# Altium project HainanU-Shark-X-Controller.PrjPcb
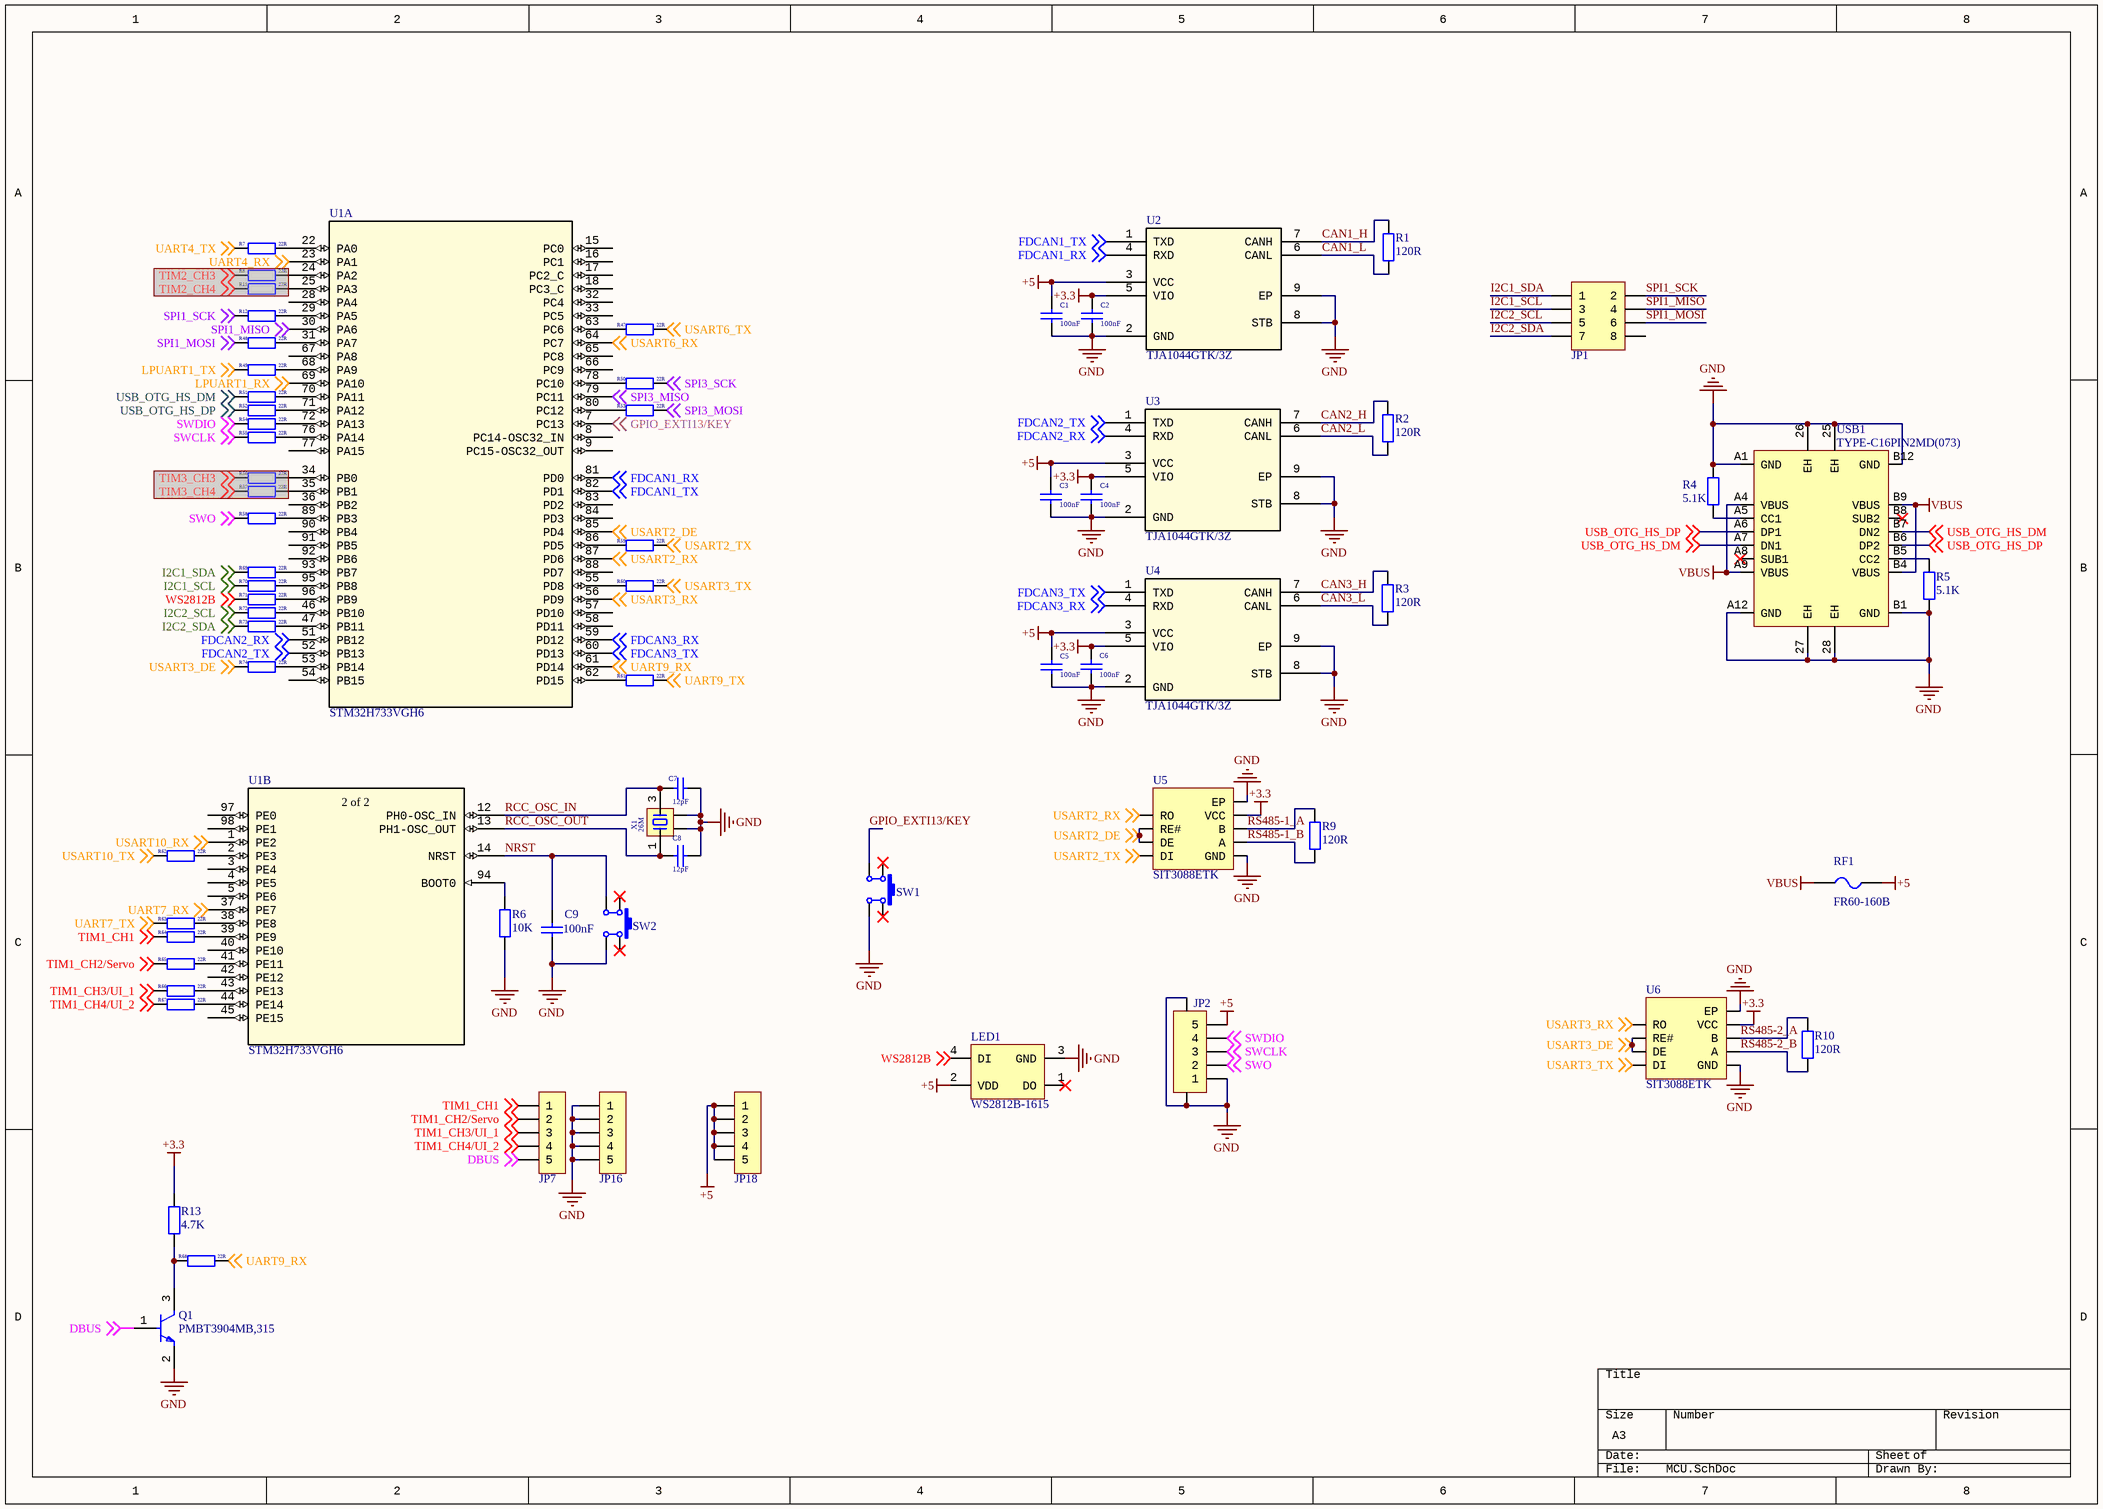
[diagram p0: MCU.SchDoc]
3 sheets, 178 parts. Net scope: global (net labels, ports and power ports of the same name join across sheets).
Board file: HainanU-Shark-X-Controller.PcbDoc
Sheets:
  MCU.SchDoc
  Power.SchDoc
  Sheet1.SchDoc

## Sheet MCU.SchDoc
size A3; SheetNumber: 1; SheetTotal: 3

### Parts
C1  100nF  [C0402_L]
C2  100nF  [C0402_L]
C3  100nF  [C0402_L]
C4  100nF  [C0402_L]
C5  100nF  [C0402_L]
C6  100nF  [C0402_L]
C7  12pF  [C0402_L]
C8  12pF  [C0402_L]
C9  100nF  [C0402_L]
JP1  Header 4X2  [IDC2.54-LI-2x4P]  (value not drawn)
JP2  CON-5P  [SH1.0-WT-5P]  (value not drawn)
JP7  HDR-1X5  [HDR2.54-LI-5P]  (value not drawn)
JP16  HDR-1X5  [HDR2.54-LI-5P]  (value not drawn)
JP18  HDR-1X5  [HDR2.54-LI-5P]  (value not drawn)
LED1  WS2812B-1615  [XL-1615RGBC-WS2812B]
Q1  PMBT3904MB,315  [FP-SOT883B-MFG]
R1  120R  [R0402_M]
R2  120R  [R0402_M]
R3  120R  [R0402_M]
R4  5.1K  [R0402_M]
R5  5.1K  [R0402_M]
R6  10K  [R0402_M]
R7  22R  [R0402_M]
R8  22R  [R0402_M]  (masked out: inside a compile mask, not in the netlist)
R9  120R  [R0402_M]
R10  120R  [R0402_M]
R11  22R  [R0402_M]  (masked out: inside a compile mask, not in the netlist)
R12  22R  [R0402_M]
R13  4.7K  [R0402_M]
R47  22R  [R0402_M]
R48  22R  [R0402_M]
R49  22R  [R0402_M]
R50  22R  [R0402_M]
R51  22R  [R0402_M]
R52  22R  [R0402_M]
R53  22R  [R0402_M]
R54  22R  [R0402_M]
R55  22R  [R0402_M]
R56  22R  [R0402_M]  (masked out: inside a compile mask, not in the netlist)
R57  22R  [R0402_M]  (masked out: inside a compile mask, not in the netlist)
R58  22R  [R0402_M]
R59  22R  [R0402_M]
R60  22R  [R0402_M]
R61  22R  [R0402_M]
R62  22R  [R0402_M]
R63  22R  [R0402_M]
R64  22R  [R0402_M]
R65  22R  [R0402_M]
R66  22R  [R0402_M]
R67  22R  [R0402_M]
R68  22R  [R0402_M]
R69  22R  [R0402_M]
R70  22R  [R0402_M]
R71  22R  [R0402_M]
R72  22R  [R0402_M]
R73  22R  [R0402_M]
R74  22R  [R0402_M]
RF1  FR60-160B  [F0603]
SW1  TD-1187SA-250  [SW-SMD-3.5*3.0_4P]  (value not drawn)
SW2  TD-1187SA-250  [SW-SMD-3.5*3.0_4P]  (value not drawn)
U1  STM32H733VGH6  [LQFP100_STM]  (parts A,B of 3)
U2  TJA1044GTK/3Z  [SON8_TJA1044GTK3Z_NXP-L]
U3  TJA1044GTK/3Z  [SON8_TJA1044GTK3Z_NXP-L]
U4  TJA1044GTK/3Z  [SON8_TJA1044GTK3Z_NXP-L]
U5  SIT3088ETK  [DFN-8_L3.0-W3.0-P0.65-BL-EP]
U6  SIT3088ETK  [DFN-8_L3.0-W3.0-P0.65-BL-EP]
USB1  TYPE-C16PIN2MD(073)  [USB-C-SMD_SHOU_TYPE-C-16P-CB1.6]
X1  26M  [XTAL-3225-4P]

### Nets
+3.3: C2.1 C4.1 C6.1 R13.1 U2.5(VIO) U3.5(VIO) U4.5(VIO) U5.8(VCC) U6.8(VCC)
+5: C1.1 C3.1 C5.1 JP2.5 JP18.1 JP18.2 JP18.3 JP18.4 JP18.5 LED1.2(VDD) RF1.1 U2.3(VCC) U3.3(VCC) U4.3(VCC)
GND: C1.2 C2.2 C3.2 C4.2 C5.2 C6.2 C7.2 C8.2 C9.2 JP2.0 JP2.1 JP16.1 JP16.2 JP16.3 JP16.4 JP16.5 LED1.3(GND) Q1.2(E) R4.2 R5.2 R6.1 SW1.3 SW2.3 U2.2(GND) U2.8(STB) U2.9(EP) U3.2(GND) U3.8(STB) U3.9(EP) U4.2(GND) U4.8(STB) U4.9(EP) U5.5(GND) U5.9(EP) U6.5(GND) U6.9(EP) USB1.25(EH) USB1.26(EH) USB1.27(EH) USB1.28(EH) USB1.A1(GND) USB1.A12(GND) USB1.B1(GND) USB1.B12(GND) X1.2 X1.4
VBUS: RF1.2 USB1.A4(VBUS) USB1.A9(VBUS) USB1.B4(VBUS) USB1.B9(VBUS)
CAN1_H: R1.2 U2.7(CANH)
CAN1_L: R1.1 U2.6(CANL)
CAN2_H: R2.2 U3.7(CANH)
CAN2_L: R2.1 U3.6(CANL)
CAN3_H: R3.2 U4.7(CANH)
CAN3_L: R3.1 U4.6(CANL)
DBUS: JP7.5 Q1.1(B) ; off-sheet DBUS
FDCAN1_RX: U1.81(PD0) U2.4(RXD) ; off-sheet FDCAN1_RX
FDCAN1_TX: U1.82(PD1) U2.1(TXD) ; off-sheet FDCAN1_TX
FDCAN2_RX: U1.51(PB12) U3.4(RXD) ; off-sheet FDCAN2_RX
FDCAN2_TX: U1.52(PB13) U3.1(TXD) ; off-sheet FDCAN2_TX
FDCAN3_RX: U1.59(PD12) U4.4(RXD) ; off-sheet FDCAN3_RX
FDCAN3_TX: U1.60(PD13) U4.1(TXD) ; off-sheet FDCAN3_TX
GPIO_EXTI13/KEY: SW1.4 U1.7(PC13) ; off-sheet GPIO_EXTI13/KEY
I2C1_SCL: JP1.3 R70.2 ; off-sheet I2C1_SCL
I2C1_SDA: JP1.1 R69.2 ; off-sheet I2C1_SDA
I2C2_SCL: JP1.5 R72.2 ; off-sheet I2C2_SCL
I2C2_SDA: JP1.7 R73.2 ; off-sheet I2C2_SDA
LPUART1_RX: U1.69(PA10) ; off-sheet LPUART1_RX
LPUART1_TX: R49.2 ; off-sheet LPUART1_TX
NRST: C9.1 SW2.4 U1.14(NRST)
RCC_OSC_IN: C7.1 U1.12(PH0-OSC_IN) X1.3
RCC_OSC_OUT: C8.1 U1.13(PH1-OSC_OUT) X1.1
RS485-1_A: R9.2 U5.7(B)
RS485-1_B: R9.1 U5.6(A)
RS485-2_A: R10.2 U6.7(B)
RS485-2_B: R10.1 U6.6(A)
SPI1_MISO: JP1.4 U1.30(PA6) ; off-sheet SPI1_MISO
SPI1_MOSI: JP1.6 R48.2 ; off-sheet SPI1_MOSI
SPI1_SCK: JP1.2 R12.2 ; off-sheet SPI1_SCK
SPI3_MISO: U1.79(PC11) ; off-sheet SPI3_MISO
SPI3_MOSI: R53.1 ; off-sheet SPI3_MOSI
SPI3_SCK: R50.1 ; off-sheet SPI3_SCK
SWCLK: JP2.3 R55.2 ; off-sheet SWCLK
SWDIO: JP2.4 R54.2 ; off-sheet SWDIO
SWO: JP2.2 R58.2 ; off-sheet SWO
TIM1_CH1: JP7.1 R64.2 ; off-sheet TIM1_CH1
TIM1_CH2/Servo: JP7.2 R65.2 ; off-sheet TIM1_CH2/Servo
TIM1_CH3/UI_1: JP7.3 R66.2 ; off-sheet TIM1_CH3/UI_1
TIM1_CH4/UI_2: JP7.4 R67.2 ; off-sheet TIM1_CH4/UI_2
UART4_RX: U1.23(PA1) ; off-sheet UART4_RX
UART4_TX: R7.2 ; off-sheet UART4_TX
UART7_RX: U1.37(PE7) ; off-sheet UART7_RX
UART7_TX: R63.2 ; off-sheet UART7_TX
UART9_RX: R68.1 U1.61(PD14) ; off-sheet UART9_RX
UART9_TX: R61.1 ; off-sheet UART9_TX
USART2_DE: U1.85(PD4) U5.2(RE#) U5.3(DE) ; off-sheet USART2_DE
USART2_RX: U1.87(PD6) U5.1(RO) ; off-sheet USART2_RX
USART2_TX: R59.1 U5.4(DI) ; off-sheet USART2_TX
USART3_DE: R74.2 U6.2(RE#) U6.3(DE) ; off-sheet USART3_DE
USART3_RX: U1.56(PD9) U6.1(RO) ; off-sheet USART3_RX
USART3_TX: R60.1 U6.4(DI) ; off-sheet USART3_TX
USART6_RX: U1.64(PC7) ; off-sheet USART6_RX
USART6_TX: R47.1 ; off-sheet USART6_TX
USART10_RX: U1.1(PE2) ; off-sheet USART10_RX
USART10_TX: R62.2 ; off-sheet USART10_TX
USB_OTG_HS_DM: R51.2 USB1.A7(DN1) USB1.B7(DN2) ; off-sheet USB_OTG_HS_DM
USB_OTG_HS_DP: R52.2 USB1.A6(DP1) USB1.B6(DP2) ; off-sheet USB_OTG_HS_DP
WS2812B: LED1.4(DI) R71.2 ; off-sheet WS2812B
NetQ1_3: Q1.3(C) R13.2 R68.2
NetR4_1: R4.1 USB1.A5(CC1)
NetR5_1: R5.1 USB1.B5(CC2)
NetR6_2: R6.2 U1.94(BOOT0)
NetR7_1: R7.1 U1.22(PA0)
NetR12_1: R12.1 U1.29(PA5)
NetR47_2: R47.2 U1.63(PC6)
NetR48_1: R48.1 U1.31(PA7)
NetR49_1: R49.1 U1.68(PA9)
NetR50_2: R50.2 U1.78(PC10)
NetR51_1: R51.1 U1.70(PA11)
NetR52_1: R52.1 U1.71(PA12)
NetR53_2: R53.2 U1.80(PC12)
NetR54_1: R54.1 U1.72(PA13)
NetR55_1: R55.1 U1.76(PA14)
NetR58_1: R58.1 U1.89(PB3)
NetR59_2: R59.2 U1.86(PD5)
NetR60_2: R60.2 U1.55(PD8)
NetR61_2: R61.2 U1.62(PD15)
NetR62_1: R62.1 U1.2(PE3)
NetR63_1: R63.1 U1.38(PE8)
NetR64_1: R64.1 U1.39(PE9)
NetR65_1: R65.1 U1.41(PE11)
NetR66_1: R66.1 U1.43(PE13)
NetR67_1: R67.1 U1.44(PE14)
NetR69_1: R69.1 U1.93(PB7)
NetR70_1: R70.1 U1.95(PB8)
NetR71_1: R71.1 U1.96(PB9)
NetR72_1: R72.1 U1.46(PB10)
NetR73_1: R73.1 U1.47(PB11)
NetR74_1: R74.1 U1.53(PB14)

Not connected (* = marked no-connect by the designer): JP1 8; LED1 1(DO)*; SW1 1* 2*; SW2 1* 2*; U1 3(PE4) 4(PE5) 5(PE6) 8(PC14-OSC32_IN) 9(PC15-OSC32_OUT) 15(PC0) 16(PC1) 17(PC2_C) 18(PC3_C) 24(PA2) 25(PA3) 28(PA4) 32(PC4) 33(PC5) 34(PB0) 35(PB1) 36(PB2) 40(PE10) 42(PE12) 45(PE15) 54(PB15) 57(PD10) 58(PD11) 65(PC8) 66(PC9) 67(PA8) 77(PA15) 83(PD2) 84(PD3) 88(PD7) 90(PB4) 91(PB5) 92(PB6) 97(PE0) 98(PE1); USB1 A8(SUB1)* B8(SUB2)*

### Notes on the sheet
- (in symbol CMP-00027-1, part B) 2 of 2

### Library data of the parts
C1-C9 = C: 贴片电容/MLCC电容; BOM名称: 无极性贴片电容; 当前库版本V2023.5.31 @淘宝卖家:黄晶宝石: 最新版本发布https://item.taobao.com/item.htm?id=566775463719
JP1 = Header 4X2: 4*2P接插件; 联系卖家，免费查找封装: 唯一出售店铺网址https://shop463601444.taobao.com; 封装库来自淘宝卖家ID：黄晶宝石: 其他店铺购入均为盗版封装库，请立即申请退款，本店现金奖励50~200元; BOM名称: 4*2P接插件
JP2 = Header 5: 5P连接器; 封装库来自淘宝卖家：黄晶宝石: 获取最新版本https://shop463601444.taobao.com; BOM名称: 5P连接器
JP7 JP16 JP18 = Header 5: 5P接插件; 联系卖家，免费查找封装: 唯一出售店铺网址https://shop463601444.taobao.com; 封装库来自淘宝卖家ID：黄晶宝石: 其他店铺购入均为盗版封装库，请立即申请退款，本店现金奖励50~200元; BOM名称: 5P接插件
LED1 = CMP-00052-1: LED幻彩灯珠
Q1 = CMP-14406-000022-1: TRANS NPN 40V 0.2A 3DFN
R1-R12 R47-R74 = R: 贴片电阻; 联系下单店铺卖家 免费帮你查找封装: 联系下单店铺卖家 免费技术支持; BOM名称: 贴片电阻
R13 = CMP-005-000000-1: 贴片电阻; 联系下单店铺卖家 免费帮你查找封装: 联系下单店铺卖家 免费技术支持; BOM名称: 贴片电阻; Source: 0.1 - 电阻-电容-电感-保险丝-晶振-晶体-磁珠-电位器-法拉电容-馈通电容.SchLib; Design Item ID: R
RF1 = FUSE-PPTC: PPTC自恢复保险丝; 当前库版本V2023.5.31 @淘宝卖家:黄晶宝石: 最新版本发布https://item.taobao.com/item.htm?id=566775463719; BOM名称: PPTC自恢复保险丝
SW1 SW2 = TD-1187SA-250: 小乌龟-侧按4脚开关 带定位柱; 联系下单店铺卖家 免费技术支持: 联系下单店铺卖家 免费帮你查找封装
U1 = CMP-00027-1: High-performance and DSP with DP-FPU, Arm Cortex-M7 MCU with 1 MByte Flash, 564 Kbytes RAM, 550 MHz CPU, L1 cache,...
U2-U4 = CMP-00028-4: CAN High Speed Transceiver 1Mbps Normal/Standby 4.75V to 5.25V 8-Pin HVSON T/R
U5 U6 = CMP-00068-2
USB1 = CMP-00067-1
X1 = XTAL-4P: 4脚无源晶振(谐振器）; 联系下单店铺卖家 免费帮你查找封装: 联系下单店铺卖家 免费技术支持; BOM名称: 4脚无源晶振(谐振器）

## Sheet Power.SchDoc
size A3; SheetNumber: 2; SheetTotal: 3
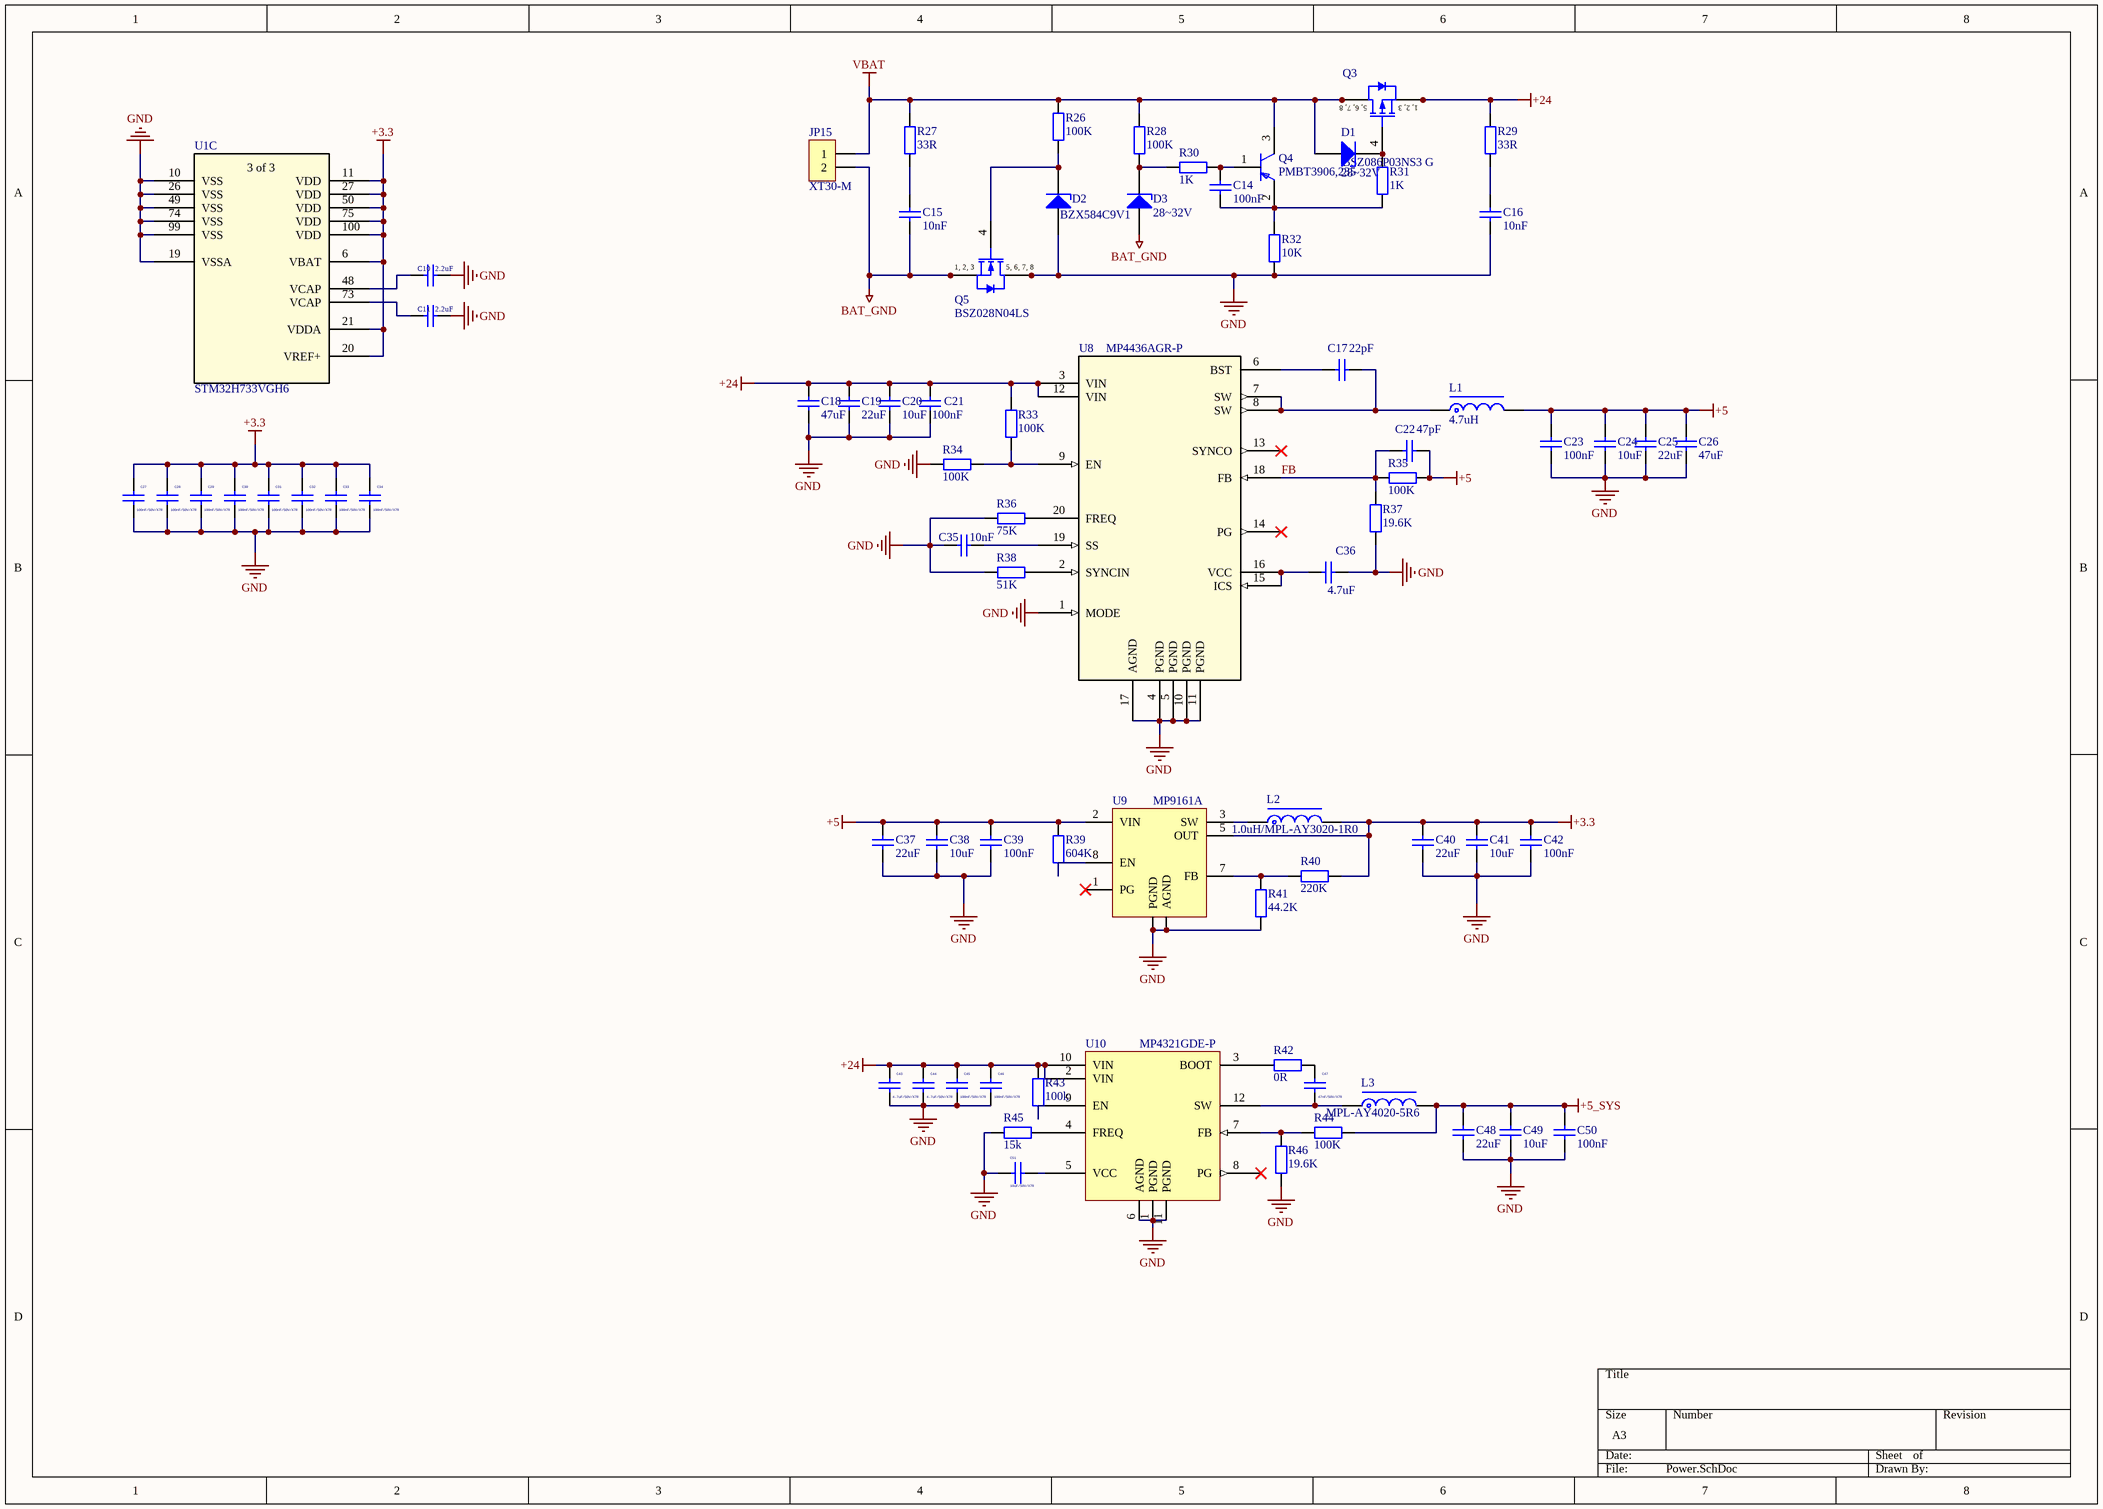
[diagram p1: Power.SchDoc]

### Parts
C10  2.2uF  [C0402_L]
C11  2.2uF  [C0402_L]
C14  100nF  [C0402_M]
C15  10nF  [C0402_M]
C16  10nF  [C0402_M]
C17  22pF  [C0402_M]
C18  47uF  [C1206_L]
C19  22uF  [C0805_L]
C20  10uF  [C0603_L]
C21  100nF  [C0603_L]
C22  47pF  [C0402_M]
C23  100nF  [C0603_L]
C24  10uF  [C0603_L]
C25  22uF  [C0805_L]
C26  47uF  [C1206_L]
C27  100nF/50V/X7R  [C0402_L]
C28  100nF/50V/X7R  [C0402_L]
C29  100nF/50V/X7R  [C0402_L]
C30  100nF/50V/X7R  [C0402_L]
C31  100nF/50V/X7R  [C0402_L]
C32  100nF/50V/X7R  [C0402_L]
C33  100nF/50V/X7R  [C0402_L]
C34  100nF/50V/X7R  [C0402_L]
C35  10nF  [C0402_M]
C36  4.7uF  [C0402_M]
C37  22uF  [C0805_M]
C38  10uF  [C0603_M]
C39  100nF  [C0402_M]
C40  22uF  [C0603_M]
C41  10uF  [C0402_M]
C42  100nF  [C0402_M]
C43  4.7uF/50V/X7R  [C0402_L]
C44  4.7uF/50V/X7R  [C0402_L]
C45  100nF/50V/X7R  [C0402_L]
C46  100nF/50V/X7R  [C0402_L]
C47  47nF/50V/X7R  [C0402_L]
C48  22uF  [C0603_M]
C49  10uF  [C0402_M]
C50  100nF  [C0402_M]
C51  10uF/50V/X7R  [C0402_L]
D1  28~32V  [SOD-523]
D2  BZX584C9V1  [SOD-523]
D3  28~32V  [SOD-523]
JP15  XT30-M  [XT30PW-M]
L1  4.7uH  [MPL-AL6050]
L2  1.0uH/MPL-AY3020-1R0  [MPL-AY3020]
L3  MPL-AY4020-5R6  [MPL-AY4020]
Q3  BSZ086P03NS3 G  [INF-PG-TSDSON-8-1_V]
Q4  PMBT3906,235  [FP-SOT23-IPC_C]
Q5  BSZ028N04LS  [INF-PG-TSDSON-8_FL_V]
R26  100K  [R0402_M]
R27  33R  [R0402_M]
R28  100K  [R0402_M]
R29  33R  [R0402_M]
R30  1K  [R0402_M]
R31  1K  [R0402_M]
R32  10K  [R0402_M]
R33  100K  [R0402_M]
R34  100K  [R0402_M]
R35  100K  [R0402_M]
R36  75K  [R0402_M]
R37  19.6K  [R0402_M]
R38  51K  [R0402_M]
R39  604K  [R0402_L]
R40  220K  [R0402_L]
R41  44.2K  [R0402_L]
R42  0R  [R0402_L]
R43  100k  [R0402_L]
R44  100K  [R0402_L]
R45  15k  [R0402_L]
R46  19.6K  [R0402_L]
U1  STM32H733VGH6  [LQFP100_STM]  (part C of 3)
U8  MP4436AGR-P  [QFN-20_4MMX4MM_MPS]
U9  MP9161A  [SOT23-8]
U10  MP4321GDE-P  [QFN-12_MP4321_MNP]

### Nets
+3.3: C27.2 C28.2 C29.2 C30.2 C31.2 C32.2 C33.2 C34.2 C40.2 C41.2 C42.2 L2.2 R40.2 U1.6(VBAT) U1.11(VDD) U1.20(VREF+) U1.21(VDDA) U1.27(VDD) U1.50(VDD) U1.75(VDD) U1.100(VDD) U9.5(OUT)
+5: C22.2 C23.2 C24.2 C25.2 C26.1 C37.2 C38.2 C39.2 L1.2 R35.2 R39.2 U9.2(VIN)
+5_SYS: C48.2 C49.2 C50.2 L3.2 R44.1
+24: C18.1 C19.1 C20.1 C21.1 C43.2 C44.2 C45.2 C46.2 Q3.1(SOURCE) Q3.2(SOURCE) Q3.3(SOURCE) R29.1 R33.2 R43.2 U8.3(VIN) U8.12(VIN) U10.2(VIN) U10.10(VIN)
BAT_GND: C15.2 D3.1(A) JP15.2 Q5.1(SOURCE) Q5.2(SOURCE) Q5.3(SOURCE)
GND: C10.2 C11.2 C16.2 C18.2 C19.2 C20.2 C21.2 C23.1 C24.1 C25.1 C26.2 C27.1 C28.1 C29.1 C30.1 C31.1 C32.1 C33.1 C34.1 C35.1 C36.1 C37.1 C38.1 C39.1 C40.1 C41.1 C42.1 C43.1 C44.1 C45.1 C46.1 C48.1 C49.1 C50.1 C51.2 D2.1(A) Q5.5(DRAIN) Q5.6(DRAIN) Q5.7(DRAIN) Q5.8(DRAIN) R32.2 R34.2 R36.2 R37.1 R38.2 R41.2 R45.2 R46.2 U1.10(VSS) U1.19(VSSA) U1.26(VSS) U1.49(VSS) U1.74(VSS) U1.99(VSS) U8.1(MODE) U8.4(PGND) U8.5(PGND) U8.10(PGND) U8.11(PGND) U8.17(AGND) U9.4(PGND) U9.6(AGND) U10.1(PGND) U10.6(AGND) U10.11(PGND)
VBAT: D1.1(A) JP15.1 Q3.5(DRAIN) Q3.6(DRAIN) Q3.7(DRAIN) Q3.8(DRAIN) Q4.3(C) R26.2 R27.2 R28.2
FB: C22.1 R35.1 R37.2 U8.18(FB)
NetC10_1: C10.1 U1.48(VCAP)
NetC11_1: C11.1 U1.73(VCAP)
NetC14_1: C14.1 Q4.1(B) R30.1
NetC14_2: C14.2 Q4.2(E) R31.2 R32.1
NetC15_1: C15.1 R27.1
NetC16_1: C16.1 R29.2
NetC17_1: C17.1 U8.6(BST)
NetC17_2: C17.2 L1.1 U8.7(SW) U8.8(SW)
NetC35_2: C35.2 U8.19(SS)
NetC36_2: C36.2 U8.15(ICS) U8.16(VCC)
NetC47_1: C47.1 L3.1 U10.12(SW)
NetC47_2: C47.2 R42.1
NetC51_1: C51.1 U10.5(VCC)
NetD1_2: D1.2(K) Q3.4(GATE) R31.1
NetD2_2: D2.2(K) Q5.4(GATE) R26.1
NetD3_2: D3.2(K) R28.1 R30.2
NetL2_1: L2.1 U9.3(SW)
NetR33_1: R33.1 R34.1 U8.9(EN)
NetR36_1: R36.1 U8.20(FREQ)
NetR38_1: R38.1 U8.2(SYNCIN)
NetR39_1: R39.1 U9.8(EN)
NetR40_1: R40.1 R41.1 U9.7(FB)
NetR42_2: R42.2 U10.3(BOOT)
NetR43_1: R43.1 U10.9(EN)
NetR44_2: R44.2 R46.1 U10.7(FB)
NetR45_1: R45.1 U10.4(FREQ)

Not connected (* = marked no-connect by the designer): U8 13(SYNCO)* 14(PG)*; U9 1(PG)*; U10 8(PG)*

### Notes on the sheet
- (in symbol CMP-00027-1, part C) 3 of 3
- (in symbol CMP-1091-00292-1) 1, 2, 3; 5, 6, 7, 8
- (in symbol CMP-1099-00063-1) 5, 6, 7, 8; 1, 2, 3

### Library data of the parts
C10 C11 C18-C21 C23-C51 = C: as C1 on sheet MCU
C14-C17 C22 = CMP-002-000000-1: 贴片电容/MLCC电容; BOM名称: 无极性贴片电容; 当前库版本V2023.5.31 @淘宝卖家:黄晶宝石: 最新版本发布https://item.taobao.com/item.htm?id=566775463719; Design Item ID: C; Source: 0.1 - 电阻-电容-电感-保险丝-晶振-晶体-磁珠-电位器-法拉电容-馈通电容.SchLib
D1-D3 = 稳压二极管: Zener Diode; 当前库版本V2023.5.31 @淘宝卖家:黄晶宝石: 最新版本发布https://shop463601444.taobao.com
JP15 = XT30-M: XT30公头; 当前库版本V2023.5.31 @淘宝卖家:黄晶宝石: 最新版本发布https://shop463601444.taobao.com
L1-L3 = L-Molding Choke: 一体成型电感; 当前库版本V2023.5.31 @淘宝卖家:黄晶宝石: 最新版本发布https://item.taobao.com/item.htm?id=566775463719; BOM名称: 一体成型电感
Q3 = CMP-1099-00063-1: P-Channel OptiMOS P3 Power-Transistor, -30 V VDS, -40 A ID, -55 to 150 degC, PG-TSDSON-8-1, Reel, Green; Manufacturer: Infineon; RDS (on) (max): 8.6Â mOhm; Rth: 1.8Â K/W; QG: 43.2Â nC; VGS(th) (max): -1.9Â V; RthJC (max): 1.8 K/W; Green: TRUE; Pto t (max): 69Â W; ID (max): -40Â A; IDpuls (max): -160Â A; VDS (max): -30Â V; VGS(th) (min): -3.1Â V; ComponentLink1URL: http://www.infineon.com/; ComponentLink2URL: http://www.infineon.com/dgdl/BSZ086P03NS3+G_2.03.pdf?folderId=db3a304314dca38901154a7313d21a66&fileId=db3a30431ff9881501203d3a5e7d17a9; Mounting Technology: Surface Mount; PartNumber: BSZ086P03NS3 G; Packing: Reel; PackageVersion: Rev. 02, 09/2008; Halogen-free: TRUE; ComponentLink3URL: http://www.infineon.com/dgdl/BSZ240N12NS3+Rev2.0.pdf?folderId=db3a304313b8b5a60113cee8763b02d7&fileId=db3a30432a40a650012a42f3057a0038; PackageDescription: 8-Pin Plastic (Green) Thin Dual Small Outline Non-Leaded Package, 3.3 x 3.3 mm Body, 0.65 mm Pitch; PackageReference: PG-TSDSON-8-1; DatasheetVersion: Rev. 2.03; ComponentLink2Description: Datasheet; ComponentLink3Description: Package Specification; ComponentLink1Description: Manufacturer URL
Q4 = CMP-14406-000050-1: TRANS PNP 40V 200MA TO236AB; RoHS Compliant: Yes
Q5 = CMP-1091-00292-1: N-Channel OptiMOS(TM) Power-MOSFET, 40 V VDS, 40 A ID, -55 to 150 degC, PG-TSDSON-8, Reel, Green; Manufacturer: Infineon; RDS (on) (max) (@4.5V): 3.8Â mOhm; VGS(th) (min): 1.2Â V; IDpuls (max): 160Â A; VDS (max): 40Â V; RthJC (max): 2Â K/W; ID (max): 40Â A; VGS(th) (max): 2Â V; Polarity: N; RDS (on) (max): 2.8Â mOhm; RthJA (max): 60Â K/W; Ptot (max): 63Â W; QG: 32 nc; Green: TRUE; ComponentLink2URL: http://www.infineon.com/dgdl/BSZ028N04LS_rev2.0.pdf?folderId=db3a304313b8b5a60113cee8763b02d7&fileId=db3a304342371bb001424bb10c8b6fff; Mounting Technology: Surface Mount; ComponentLink3URL: http://www.infineon.com/dgdl/BSZ034N04LS_rev2.0.pdf?folderId=db3a304313b8b5a60113cee8763b02d7&fileId=db3a304342371bb001424c3fe5bc7083; PackageDescription: 8-Pin Plastic (Green) Thin Dual Small Outline Non-Leaded Package, 3.3 x 3.3 mm Body, 0.65 mm Pitch; ComponentLink2Description: Datasheet; ComponentLink1Description: Manufacturer URL; Packing: Reel; DatasheetVersion: Rev. 2.0; ComponentLink1URL: http://www.infineon.com/; Halogen-free: TRUE; Mounting: SMD; Technology: OptiMOS(TM); PackageVersion: Rev. 2.0, 04/2013; PartNumber: BSZ028N04LS; ComponentLink3Description: Package Specification; PackageReference: PG-TSDSON-8
R26-R38 = CMP-005-000000-1: 贴片电阻; 联系下单店铺卖家 免费帮你查找封装: 联系下单店铺卖家 免费技术支持; BOM名称: 贴片电阻; Source: 0.1 - 电阻-电容-电感-保险丝-晶振-晶体-磁珠-电位器-法拉电容-馈通电容.SchLib; Design Item ID: R
R39-R46 = CMP-005-000000-2: 贴片电阻0; 联系下单店铺卖家 免费帮你查找封装: 联系下单店铺卖家 免费技术支持; BOM名称: 贴片电阻; Source: 0.1 - 电阻-电容-电感-保险丝-晶振-晶体-磁珠-电位器-法拉电容-馈通电容.SchLib; Design Item ID: R
U1 = CMP-00027-1: as U1 on sheet MCU
U8 = CMP-00030-2: QFN 20/ Synchronous Step-Down Converter 45V, 6A, Low Iq
U9 = CMP-00064-1
U10 = CMP-00070-1: Voltage Regulator, DC/DC Gate Driver, 3.3 V to 36 V in, 0..8V to 34.2 V/1A Out, 2.42 MHz, QFN-12

## Sheet Sheet1.SchDoc
size A3; DrawnBy: WwWangGuan; SheetNumber: 3; SheetTotal: 3
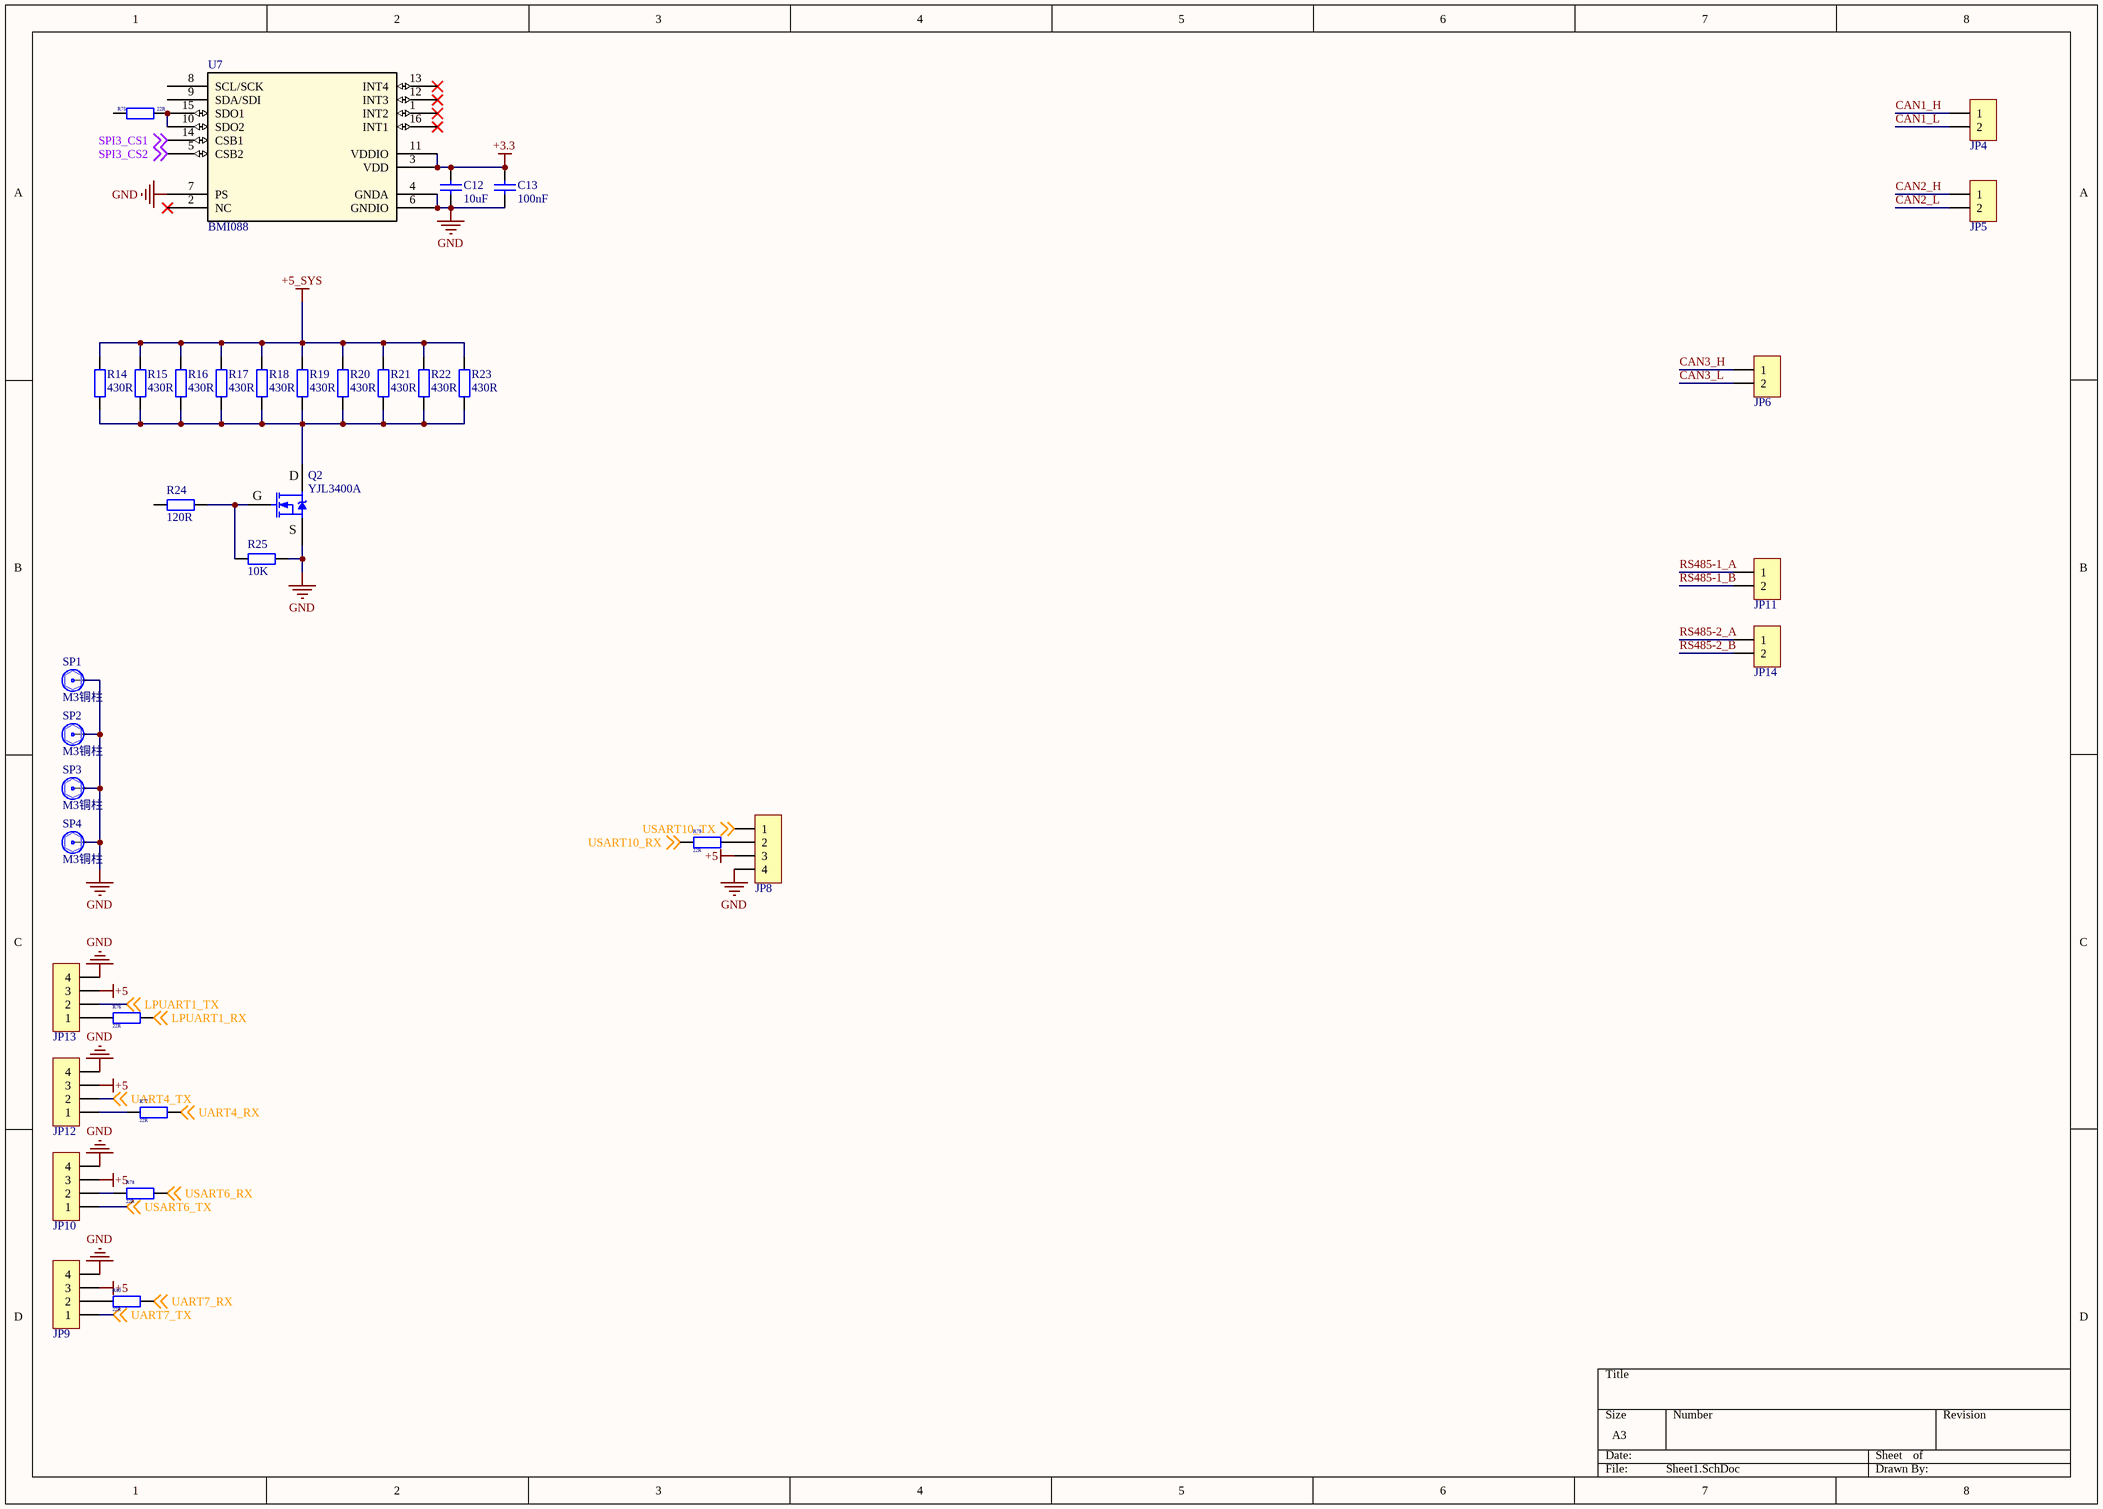
[diagram p2: Sheet1.SchDoc]

### Parts
C12  10uF  [C0402_M]
C13  100nF  [C0402_M]
JP4  HDR-1X2  [GH1.25-LT-2P]  (value not drawn)
JP5  HDR-1X2  [GH1.25-LT-2P]  (value not drawn)
JP6  HDR-1X2  [GH1.25-LT-2P]  (value not drawn)
JP8  HDR-1X4  [GH1.25-LT-4P]  (value not drawn)
JP9  HDR-1X4  [GH1.25-LT-4P]  (value not drawn)
JP10  HDR-1X4  [GH1.25-LT-4P]  (value not drawn)
JP11  HDR-1X2  [GH1.25-LT-2P]  (value not drawn)
JP12  HDR-1X4  [GH1.25-LT-4P]  (value not drawn)
JP13  HDR-1X4  [GH1.25-LT-4P]  (value not drawn)
JP14  HDR-1X2  [GH1.25-LT-2P]  (value not drawn)
Q2  YJL3400A  [SOT23-3L]
R14  430R  [R0402_M]
R15  430R  [R0402_M]
R16  430R  [R0402_M]
R17  430R  [R0402_M]
R18  430R  [R0402_M]
R19  430R  [R0402_M]
R20  430R  [R0402_M]
R21  430R  [R0402_M]
R22  430R  [R0402_M]
R23  430R  [R0402_M]
R24  120R  [R0402_M]
R25  10K  [R0402_M]
R75  22R  [R0402_M]
R76  22R  [R0402_M]
R77  22R  [R0402_M]
R78  22R  [R0402_M]
R79  22R  [R0402_M]
R80  22R  [R0402_M]
SP1  M3铜柱  [M3x4+6_N]
SP2  M3铜柱  [M3x4+6_N]
SP3  M3铜柱  [M3x4+6_N]
SP4  M3铜柱  [M3x4+6_N]
U7  BMI088  [QFN_BMI085_BOS]

### Nets
+3.3: C12.1 C13.1 U7.3(VDD) U7.11(VDDIO)
+5: JP8.3 JP9.3 JP10.3 JP12.3 JP13.3
+5_SYS: R14.2 R15.2 R16.2 R17.2 R18.2 R19.2 R20.2 R21.2 R22.2 R23.2
GND: C12.2 C13.2 JP8.4 JP9.4 JP10.4 JP12.4 JP13.4 Q2.2(S) R25.1 SP1.1 SP2.1 SP3.1 SP4.1 U7.4(GNDA) U7.6(GNDIO) U7.7(PS)
CAN1_H: JP4.1
CAN1_L: JP4.2
CAN2_H: JP5.1
CAN2_L: JP5.2
CAN3_H: JP6.1
CAN3_L: JP6.2
LPUART1_RX: R76.2 ; off-sheet LPUART1_RX
LPUART1_TX: JP13.2 ; off-sheet LPUART1_TX
RS485-1_A: JP11.1
RS485-1_B: JP11.2
RS485-2_A: JP14.1
RS485-2_B: JP14.2
SPI3_CS1: U7.14(CSB1) ; off-sheet SPI3_CS1
SPI3_CS2: U7.5(CSB2) ; off-sheet SPI3_CS2
UART4_RX: R77.2 ; off-sheet UART4_RX
UART4_TX: JP12.2 ; off-sheet UART4_TX
UART7_RX: R80.2 ; off-sheet UART7_RX
UART7_TX: JP9.1 ; off-sheet UART7_TX
USART6_RX: R78.2 ; off-sheet USART6_RX
USART6_TX: JP10.1 ; off-sheet USART6_TX
USART10_RX: R79.1 ; off-sheet USART10_RX
USART10_TX: JP8.1 ; off-sheet USART10_TX
NetJP8_2: JP8.2 R79.2
NetJP9_2: JP9.2 R80.1
NetJP10_2: JP10.2 R78.1
NetJP12_1: JP12.1 R77.1
NetJP13_1: JP13.1 R76.1
NetQ2_1: Q2.1(G) R24.1 R25.2
NetQ2_3: Q2.3(D) R14.1 R15.1 R16.1 R17.1 R18.1 R19.1 R20.1 R21.1 R22.1 R23.1
NetR75_1: R75.1 U7.10(SDO2) U7.15(SDO1)

Not connected (* = marked no-connect by the designer): R24 2; R75 2; U7 1(INT2)* 2(NC)* 8(SCL/SCK) 9(SDA/SDI) 12(INT3)* 13(INT4)* 16(INT1)*

### Library data of the parts
C12 C13 = CMP-002-000000-1: as C14 on sheet Power; Design Item ID: C; Source: 0.1 - 电阻-电容-电感-保险丝-晶振-晶体-磁珠-电位器-法拉电容-馈通电容.SchLib
JP4-JP6 JP11 JP14 = Header 2: 2P连接器; 联系卖家 免费技术支持: 封装库来自淘宝卖家ID：黄晶宝石; BOM名称: 2P连接器
JP8-JP10 JP12 JP13 = Header 4: 4P连接器; 联系卖家 免费技术支持: 封装库来自淘宝卖家ID：黄晶宝石; BOM名称: 4P连接器
Q2 = SI2306: N沟道 30V/3.16A; BOM名称: N沟道场效应管; 联系下单店铺卖家 免费帮你查找封装: 联系下单店铺卖家 免费技术支持
R14-R25 = CMP-005-000000-1: 贴片电阻; 联系下单店铺卖家 免费帮你查找封装: 联系下单店铺卖家 免费技术支持; BOM名称: 贴片电阻; Source: 0.1 - 电阻-电容-电感-保险丝-晶振-晶体-磁珠-电位器-法拉电容-馈通电容.SchLib; Design Item ID: R
R75-R80 = R: 贴片电阻; 联系下单店铺卖家 免费帮你查找封装: 联系下单店铺卖家 免费技术支持; BOM名称: 贴片电阻
SP1-SP4 = 铜柱加头大焊盘: 铜柱; 联系下单店铺卖家 免费技术支持: 联系下单店铺卖家 免费帮你查找封装; BOM名称: 铜柱
U7 = CMP-00031-3: BMI088 Series 3.6 V 6 Axis Digital Output Accelerometer Motion Sensor - LGA-16; Axis: X, Y, Z; Max Operating Temperature: 85°C; Case/Package: LGA; Min Operating Temperature: -40°C; Packaging: Cut Tape; Pins: 16; Mounting Technology: Surface Mount

## Nets that join several sheets
+3.3: MCU (9 pins), Power (22 pins), Sheet1 (C12.1 C13.1 U7.3 U7.11)
+5: MCU (14 pins), Power (12 pins), Sheet1 (5 pins)
+5_SYS: Power (5 pins), Sheet1 (10 pins)
GND: MCU (46 pins), Power (65 pins), Sheet1 (16 pins)
CAN1_H: MCU (R1.2 U2.7), Sheet1 (JP4.1)
CAN1_L: MCU (R1.1 U2.6), Sheet1 (JP4.2)
CAN2_H: MCU (R2.2 U3.7), Sheet1 (JP5.1)
CAN2_L: MCU (R2.1 U3.6), Sheet1 (JP5.2)
CAN3_H: MCU (R3.2 U4.7), Sheet1 (JP6.1)
CAN3_L: MCU (R3.1 U4.6), Sheet1 (JP6.2)
LPUART1_RX: MCU (U1.69), Sheet1 (R76.2)
LPUART1_TX: MCU (R49.2), Sheet1 (JP13.2)
RS485-1_A: MCU (R9.2 U5.7), Sheet1 (JP11.1)
RS485-1_B: MCU (R9.1 U5.6), Sheet1 (JP11.2)
RS485-2_A: MCU (R10.2 U6.7), Sheet1 (JP14.1)
RS485-2_B: MCU (R10.1 U6.6), Sheet1 (JP14.2)
UART4_RX: MCU (U1.23), Sheet1 (R77.2)
UART4_TX: MCU (R7.2), Sheet1 (JP12.2)
UART7_RX: MCU (U1.37), Sheet1 (R80.2)
UART7_TX: MCU (R63.2), Sheet1 (JP9.1)
USART6_RX: MCU (U1.64), Sheet1 (R78.2)
USART6_TX: MCU (R47.1), Sheet1 (JP10.1)
USART10_RX: MCU (U1.1), Sheet1 (R79.1)
USART10_TX: MCU (R62.2), Sheet1 (JP8.1)